# Altium schematic sheet Sheet2.SchDoc: Controle de Motor
size A4; Organization: Altium Limited; Address1: L3, 12a Rodborough Rd; Address2: Frenchs Forest; Address3: NSW; Address4: Australia 2086; DocumentNumber: 001; Revision: 0; SheetNumber: 2; SheetTotal: 2
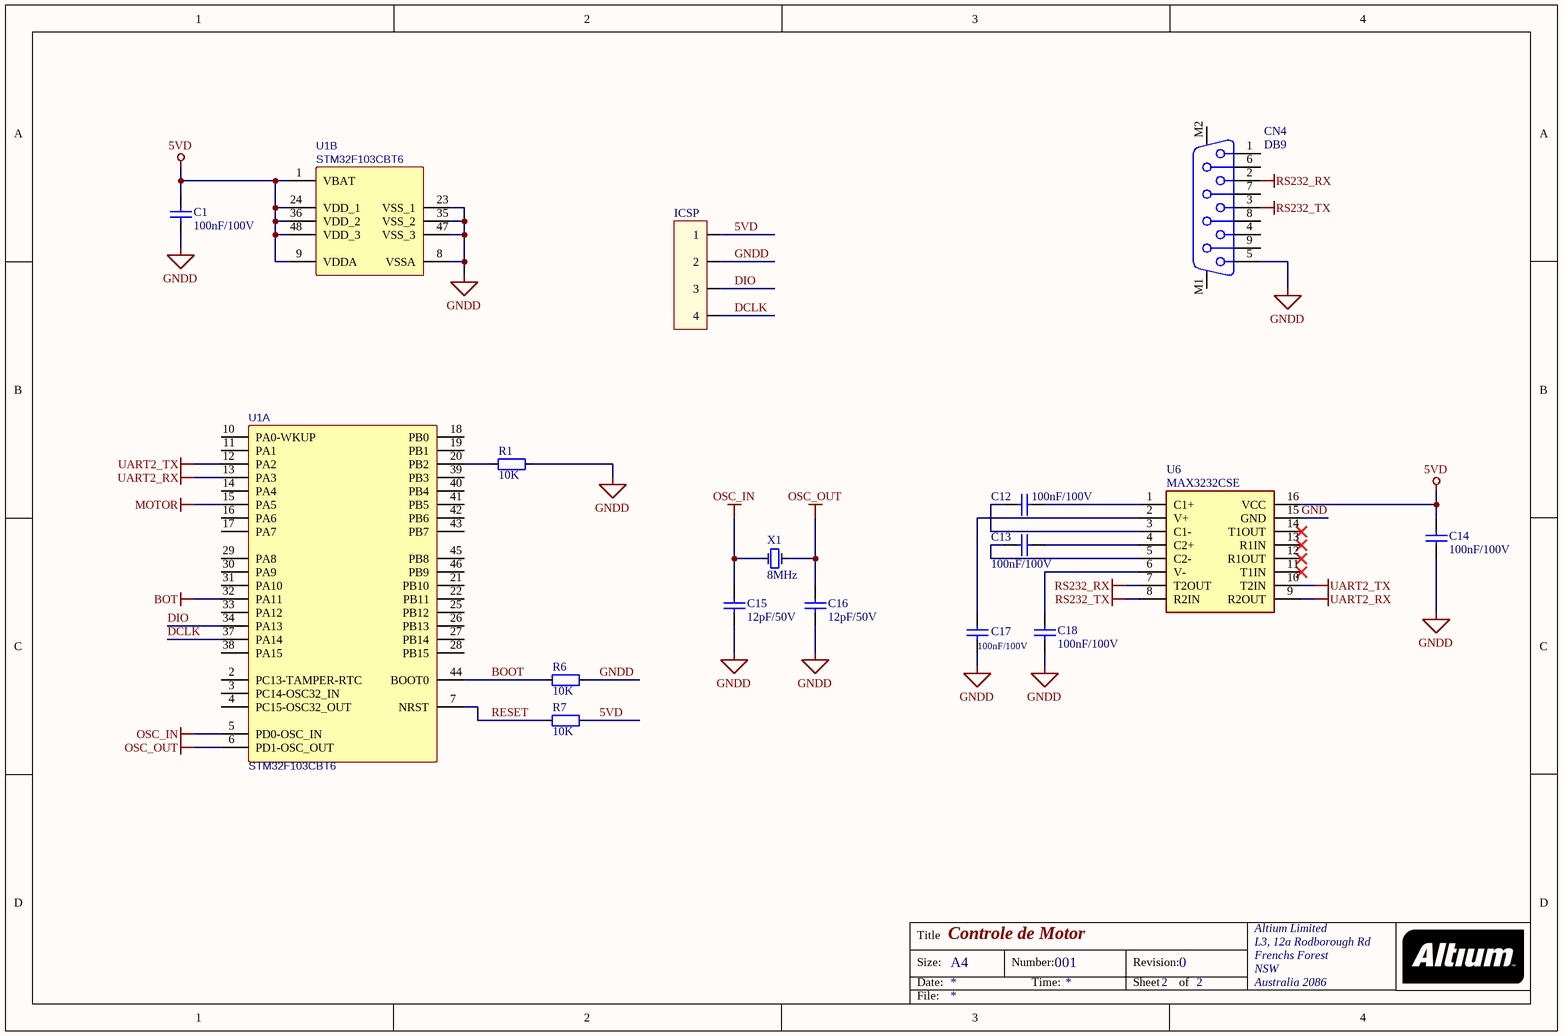
[diagram p0: Sheet2.SchDoc]

## Parts
C1  100nF/100V  [0603C-GENERIC]
C12  100nF/100V  [0603C-GENERIC]
C13  100nF/100V  [0603C-GENERIC]
C14  100nF/100V  [0603C-GENERIC]
C15  12pF/50V  [0603C-GENERIC]
C16  12pF/50V  [0603C-GENERIC]
C17  100nF/100V  [0603C-GENERIC]
C18  100nF/100V  [0603C-GENERIC]
CN4  DB9  [618009231121]
ICSP  Gravação in circuit  [BP 1x4]  (value not drawn)
R1  10K  [0603R]
R6  10K  [0603R]
R7  10K  [0603R]
U1  STM32F103CBT6  [LQFP-48]  (parts A,B of 2)
U6  MAX3232CSE  [SOIC127P600X175-16N]
X1  8MHz  [Cristal HC49S]

## Nets
5VD: C1.2 C14.1 ICSP.1 R7.1 U1.1(VBAT) U1.9(VDDA) U1.24(VDD_1) U1.36(VDD_2) U1.48(VDD_3) U6.16(VCC)
BOT: U1.32(PA11)
GNDD: C1.1 C14.2 C15.1 C16.1 C17.2 C18.2 CN4.5 ICSP.2 R1.2 R6.2 U1.8(VSSA) U1.23(VSS_1) U1.35(VSS_2) U1.47(VSS_3)
MOTOR: U1.15(PA5)
OSC_IN: C15.2 U1.5(PD0-OSC_IN) X1.2(OSC2)
OSC_OUT: C16.2 U1.6(PD1-OSC_OUT) X1.1(OSC1)
RS232_RX: CN4.2 U6.7(T2OUT)
RS232_TX: CN4.3 U6.8(R2IN)
UART2_RX: U1.13(PA3) U6.9(R2OUT)
UART2_TX: U1.12(PA2) U6.10(T2IN)
BOOT: R6.1 U1.44(BOOT0)
DCLK: ICSP.4 U1.37(PA14)
DIO: ICSP.3 U1.34(PA13)
GND: U6.15(GND)
RESET: R7.2 U1.7(NRST)
NetC12_1: C12.1 U6.1(C1+)
NetC12_2: C12.2 U6.3(C1-)
NetC13_1: C13.1 U6.4(C2+)
NetC13_2: C13.2 U6.5(C2-)
NetC17_1: C17.1 U6.2(V+)
NetC18_1: C18.1 U6.6(V-)
NetR1_1: R1.1 U1.20(PB2)

Not connected (* = marked no-connect by the designer): CN4 1 4 6 7 8 9 M1 M2; U1 2(PC13-TAMPER-RTC) 3(PC14-OSC32_IN) 4(PC15-OSC32_OUT) 10(PA0-WKUP) 11(PA1) 14(PA4) 16(PA6) 17(PA7) 18(PB0) 19(PB1) 21(PB10) 22(PB11) 25(PB12) 26(PB13) 27(PB14) 28(PB15) 29(PA8) 30(PA9) 31(PA10) 33(PA12) 38(PA15) 39(PB3) 40(PB4) 41(PB5) 42(PB6) 43(PB7) 45(PB8) 46(PB9); U6 11(T1IN)* 12(R1OUT)* 13(R1IN)* 14(T1OUT)*

## Notes on the sheet
- (near U1) BOOT1
- Title
- Size:
- Date:
- A4
- Number:
- Time:
- Revision:
- Sheet
- of
- File:

## Library data of the parts
C1 C12-C14 C17 C18 = Cap Ceramico SMD: Capacitor Cerâmico SMD; Protheus: E3CSC100N0002
C15 C16 = Cap Ceramico SMD: Capacitor Cerâmico; Protheus: E3CSC012P0002; Footprint: cap 1206; Pin Count: 2
CN4 = DB9: Connector DB9
ICSP = BP 1x4 Pinos: Barra de Pinos Macho 4p 11,2mm 180º; Protheus: E5CNM18004003
R1 R6 R7 = E3RSM010K0001: Resistor Metal Filme; Protheus: E3RSM010K0002; Value: 10K
U1 = STM32F103C8T6TR: Protheus: E2UMIC0000012; Value: STM32F103C8T6
U6 = MAX232CSE: Integrated Circuit; Protheus: E2UGER0000019
X1 = Cristal_CM200C: Cristal; Protheus: E2CRST0000004; Value: 8MHz